# Altium schematic sheet radio-rf.SchDoc
size Letter; CompanyName: Signal Laboratories, Inc.; Address1: 3479 Edison Way; Address2: Menlo Park CA 94025; Address3: +1 (877) 778-8435; Address4: siglabs.com; Revision: 1; SheetNumber: 1; SheetTotal: 1
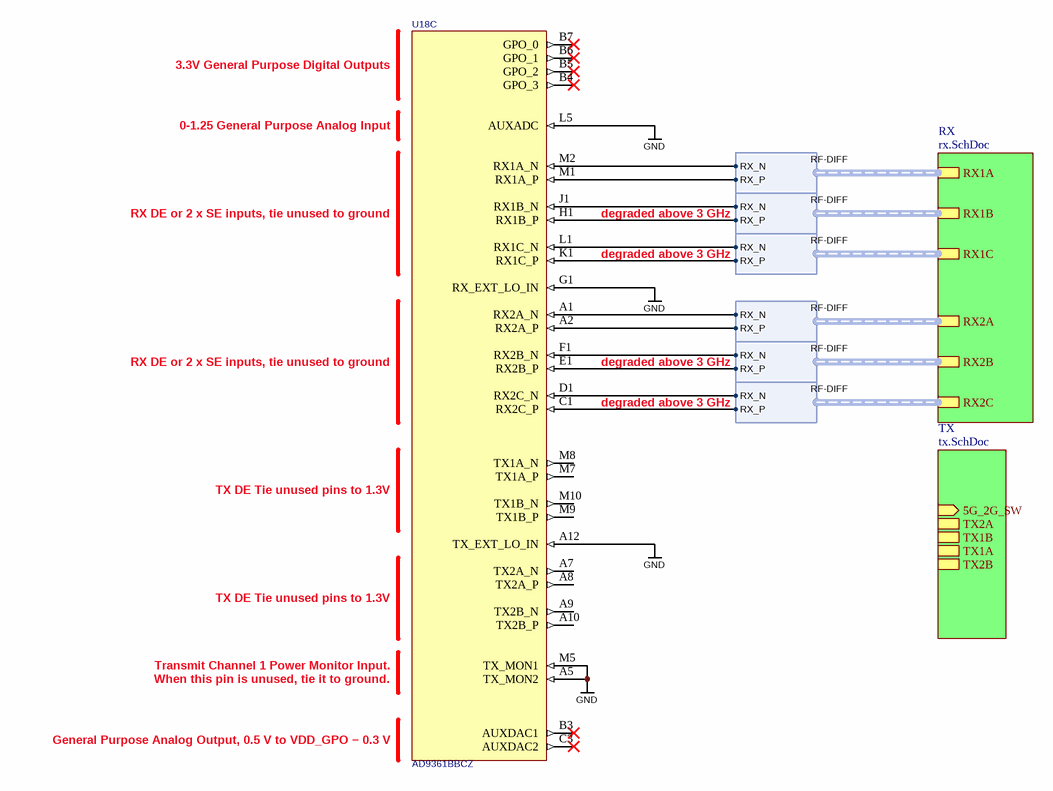
[diagram p0: radio-rf.SchDoc]

## Parts
U18  AD9361BBCZ  [BGA144C80P12X12_1000X1000X170_AD9361BBCZ(Primary)]  (part C of 4)

## Sub-sheets
RX = rx.SchDoc: RX1A (harness RF-DIFF), RX1B (harness RF-DIFF), RX1C (harness RF-DIFF), RX2A (harness RF-DIFF), RX2B (harness RF-DIFF), RX2C (harness RF-DIFF)
TX = tx.SchDoc: 5G_2G_SW (in), TX2A (harness RF-DIFF), TX1B (harness RF-DIFF), TX1A (harness RF-DIFF), TX2B (harness RF-DIFF)

## Harnesses
RF-DIFF: RX_N, RX_P

## Nets
GND: U18.A5(TX_MON2) U18.A12(TX_EXT_LO_IN) U18.G1(RX_EXT_LO_IN) U18.L5(AUXADC) U18.M5(TX_MON1)
NetU18_A1: U18.A1(RX2A_N) ; sheet RX/RX2A.RX_N
NetU18_A2: U18.A2(RX2A_P) ; sheet RX/RX2A.RX_P
NetU18_C1: U18.C1(RX2C_P) ; sheet RX/RX2C.RX_P
NetU18_D1: U18.D1(RX2C_N) ; sheet RX/RX2C.RX_N
NetU18_E1: U18.E1(RX2B_P) ; sheet RX/RX2B.RX_P
NetU18_F1: U18.F1(RX2B_N) ; sheet RX/RX2B.RX_N
NetU18_H1: U18.H1(RX1B_P) ; sheet RX/RX1B.RX_P
NetU18_J1: U18.J1(RX1B_N) ; sheet RX/RX1B.RX_N
NetU18_K1: U18.K1(RX1C_P) ; sheet RX/RX1C.RX_P
NetU18_L1: U18.L1(RX1C_N) ; sheet RX/RX1C.RX_N
NetU18_M1: U18.M1(RX1A_P) ; sheet RX/RX1A.RX_P
NetU18_M2: U18.M2(RX1A_N) ; sheet RX/RX1A.RX_N

Not connected (* = marked no-connect by the designer): U18 A7(TX2A_N) A8(TX2A_P) A9(TX2B_N) A10(TX2B_P) B3(AUXDAC1)* B4(GPO_3)* B5(GPO_2)* B6(GPO_1)* B7(GPO_0)* C3(AUXDAC2)* M7(TX1A_P) M8(TX1A_N) M9(TX1B_P) M10(TX1B_N)

## Notes on the sheet
- 3.3V General Purpose Digital Outputs
- 0-1.25 General Purpose Analog Input
- RX DE or 2 x SE inputs, tie unused to ground
- degraded above 3 GHz
- TX DE Tie unused pins to 1.3V
- Transmit Channel 1 Power Monitor Input.
- General Purpose Analog Output, 0.5 V to VDD_GPO − 0.3 V
- When this pin is unused, tie it to ground.
- Title
- Engineer
- Revision
- Drawn By
- Checked By
- Date
- Sheet
- of

## Library data of the parts
U18 = AD9361: RF Agile Transceiver